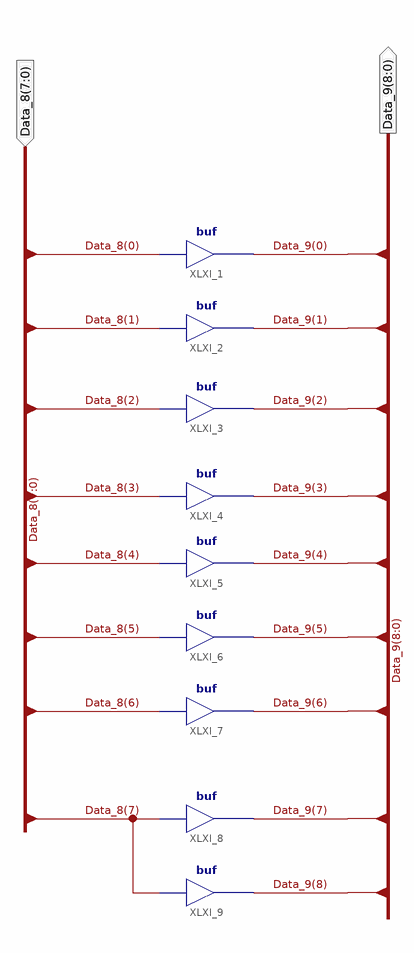
[diagram p0: schematic sheet 1]
// Xilinx ISE schematic Bit8_to_bit9.sch (spartan3e) as structural Verilog: 9 symbols, 2 ports
module Bit8_to_bit9 (
  input  [7:0] Data_8,
  output [8:0] Data_9
);

  buf XLXI_1 (Data_9[0], Data_8[0]);
  buf XLXI_2 (Data_9[1], Data_8[1]);
  buf XLXI_3 (Data_9[2], Data_8[2]);
  buf XLXI_4 (Data_9[3], Data_8[3]);
  buf XLXI_5 (Data_9[4], Data_8[4]);
  buf XLXI_6 (Data_9[5], Data_8[5]);
  buf XLXI_7 (Data_9[6], Data_8[6]);
  buf XLXI_8 (Data_9[7], Data_8[7]);
  buf XLXI_9 (Data_9[8], Data_8[7]);
endmodule
